# Altium schematic sheet foxbms2-interface-mc33664.SchDoc
size A3; DocumentNumber: 1; SheetNumber: 1; SheetTotal: 5; SheetDescription: TPL Communication
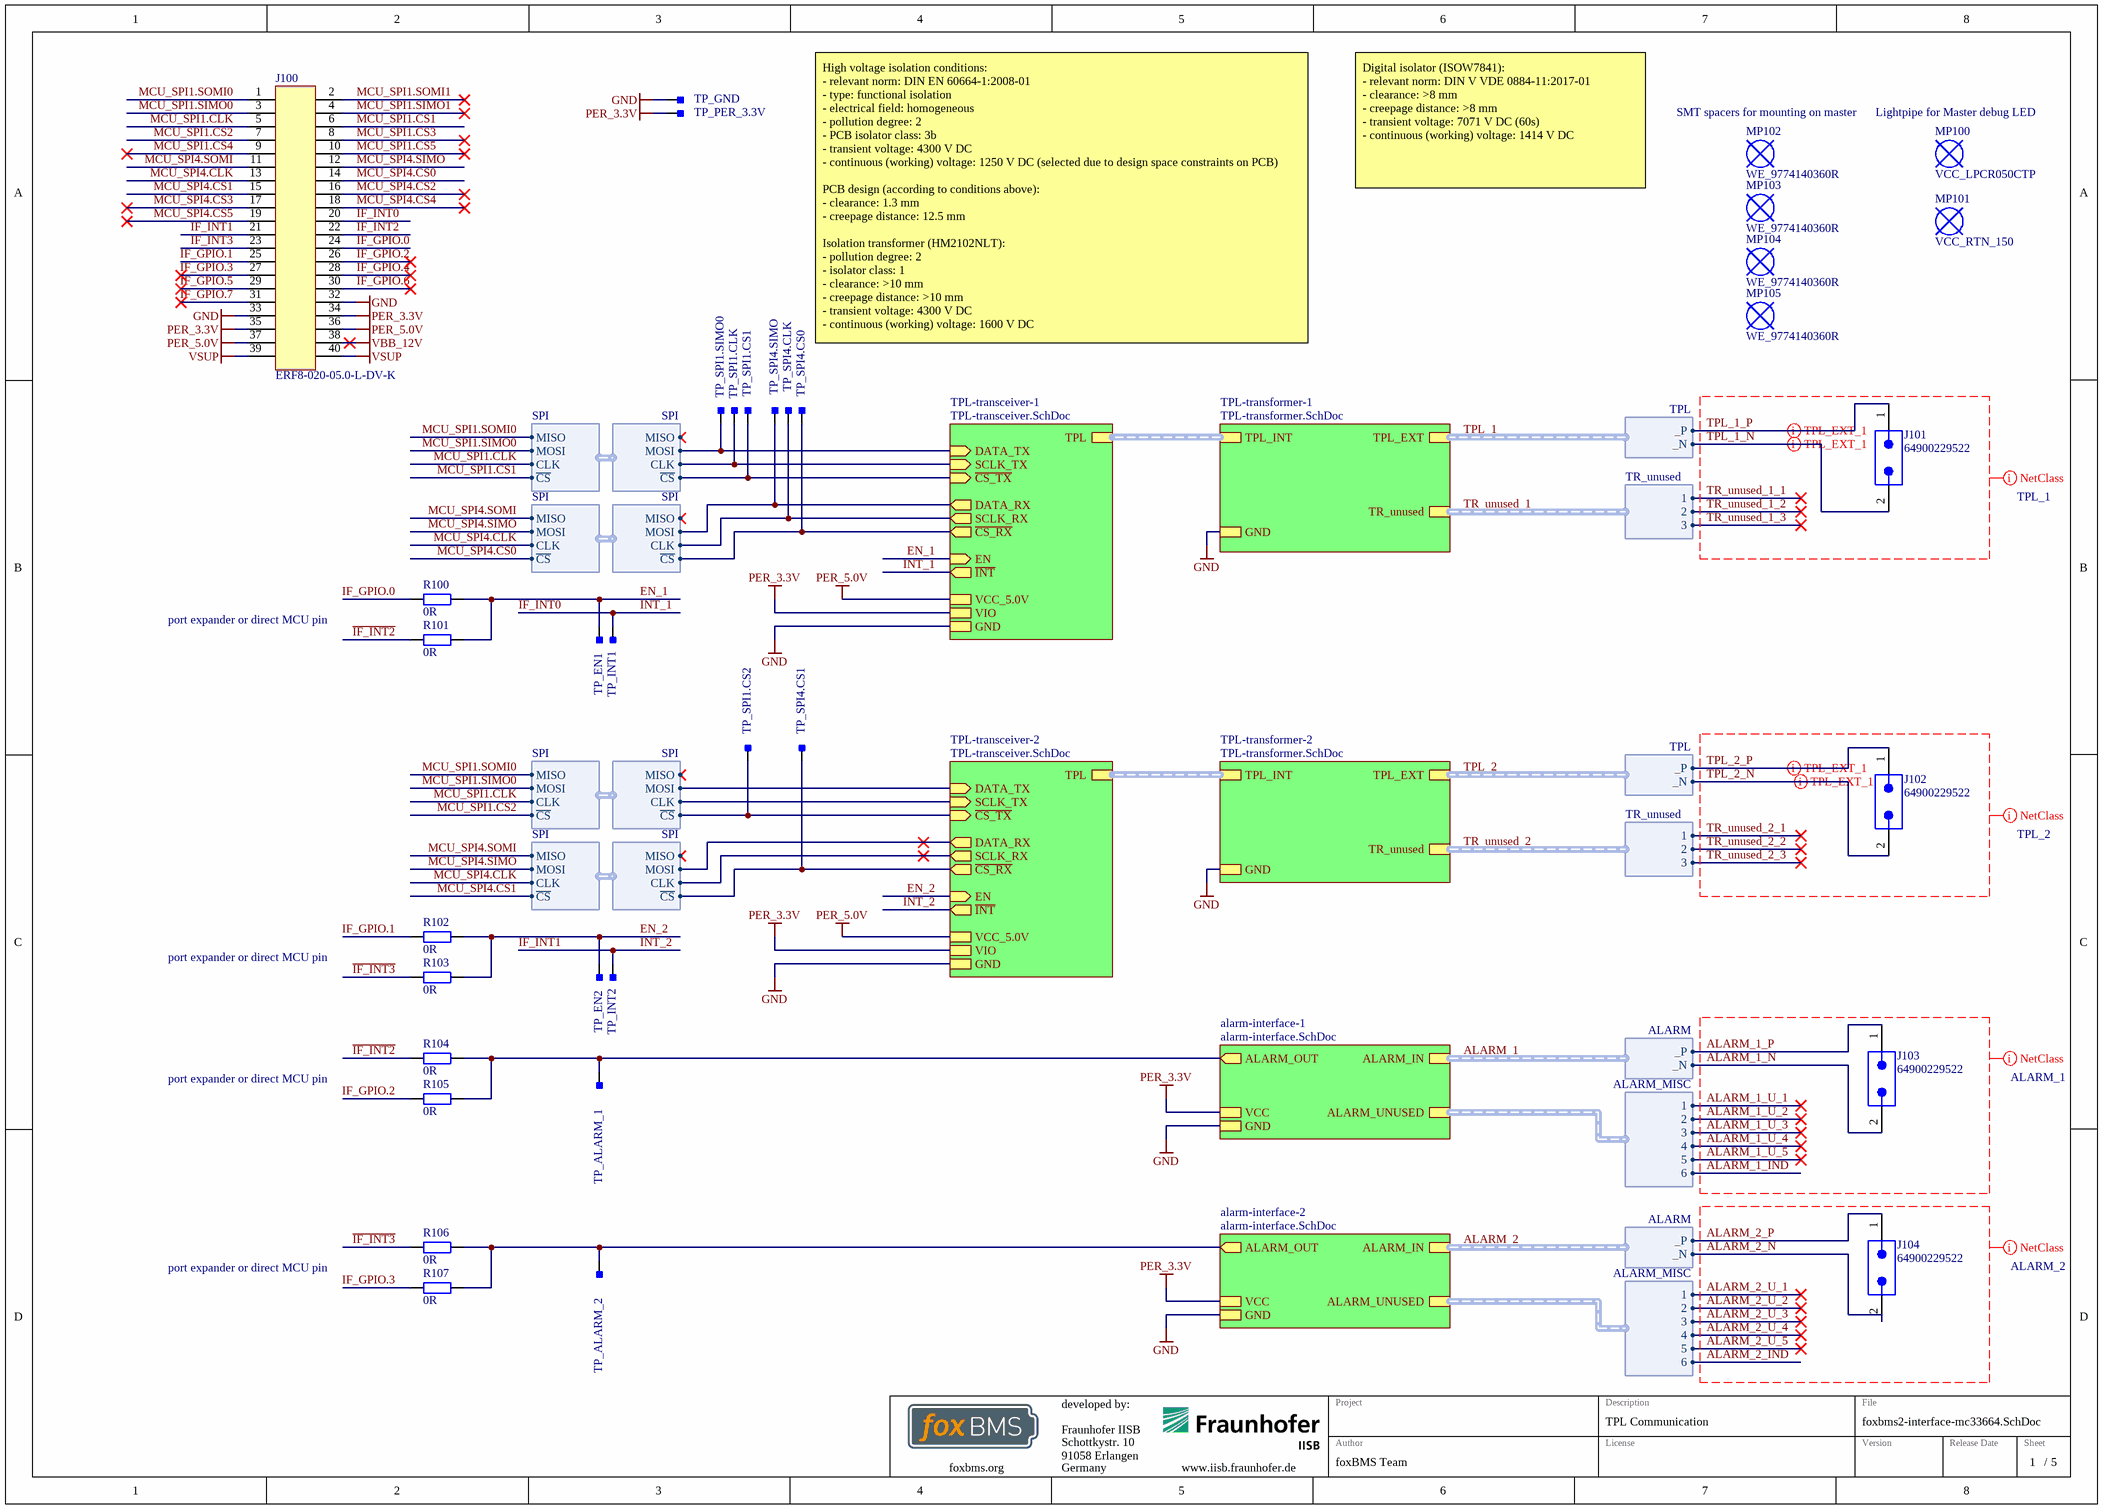
[diagram p0: foxbms2-interface-mc33664.SchDoc]

## Parts
J100  ERF8-020-05.0-L-DV-K  [SAMTEC_ERF8-020-05.0-L-DV-K]
J101  64900229522  [64900229522]
J102  64900229522  [64900229522]
J103  64900229522  [64900229522]
J104  64900229522  [64900229522]
MP100  VCC_LPCR050CTP  [VCC_LPCR050TP]  (mechanical)
MP101  VCC_RTN_150  [VCC_RTN_150]  (mechanical)
MP102  WE_9774140360R  [WE_9774140360]
MP103  WE_9774140360R  [WE_9774140360]
MP104  WE_9774140360R  [WE_9774140360]
MP105  WE_9774140360R  [WE_9774140360]
R100  0R  [RESC1608X05N]
R101  0R  [RESC1608X05N]
R102  0R  [RESC1608X05N]
R103  0R  [RESC1608X05N]
R104  0R  [RESC1608X05N]
R105  0R  [RESC1608X05N]
R106  0R  [RESC1608X05N]
R107  0R  [RESC1608X05N]
TP_ALARM_1  Testpoint_Square  [Testpoint_S1]  (value not drawn)  (no BOM)
TP_ALARM_2  Testpoint_Square  [Testpoint_S1]  (value not drawn)  (no BOM)
TP_EN1  Testpoint_Square  [Testpoint_S1]  (value not drawn)  (no BOM)
TP_EN2  Testpoint_Square  [Testpoint_S1]  (value not drawn)  (no BOM)
TP_GND  Testpoint_Square  [Testpoint_S1]  (value not drawn)  (no BOM)
TP_INT1  Testpoint_Square  [Testpoint_S1]  (value not drawn)  (no BOM)
TP_INT2  Testpoint_Square  [Testpoint_S1]  (value not drawn)  (no BOM)
TP_PER_3.3V  Testpoint_Square  [Testpoint_S1]  (value not drawn)  (no BOM)
TP_SPI1.CLK  Testpoint_Square  [Testpoint_S1]  (value not drawn)  (no BOM)
TP_SPI1.CS1  Testpoint_Square  [Testpoint_S1]  (value not drawn)  (no BOM)
TP_SPI1.CS2  Testpoint_Square  [Testpoint_S1]  (value not drawn)  (no BOM)
TP_SPI1.SIMO0  Testpoint_Square  [Testpoint_S1]  (value not drawn)  (no BOM)
TP_SPI4.CLK  Testpoint_Square  [Testpoint_S1]  (value not drawn)  (no BOM)
TP_SPI4.CS0  Testpoint_Square  [Testpoint_S1]  (value not drawn)  (no BOM)
TP_SPI4.CS1  Testpoint_Square  [Testpoint_S1]  (value not drawn)  (no BOM)
TP_SPI4.SIMO  Testpoint_Square  [Testpoint_S1]  (value not drawn)  (no BOM)

## Sub-sheets
alarm-interface-1 = alarm-interface.SchDoc: GND, VCC, ALARM_IN (harness ALARM), ALARM_OUT (out), ALARM_UNUSED (harness ALARM_MISC)
alarm-interface-2 = alarm-interface.SchDoc: GND, VCC, ALARM_IN (harness ALARM), ALARM_OUT (out), ALARM_UNUSED (harness ALARM_MISC)
TPL-transceiver-1 = TPL-transceiver.SchDoc: GND, EN (in), TPL (harness TPL), VIO, SCLK_TX (in), ~{CS_RX} (out), ~{INT} (out), DATA_RX (out), ~{CS_TX} (in), VCC_5.0V, DATA_TX (in), SCLK_RX (out)
TPL-transceiver-2 = TPL-transceiver.SchDoc: GND, EN (in), TPL (harness TPL), VIO, SCLK_TX (in), ~{CS_RX} (out), ~{INT} (out), DATA_RX (out), ~{CS_TX} (in), VCC_5.0V, DATA_TX (in), SCLK_RX (out)
TPL-transformer-1 = TPL-transformer.SchDoc: GND, TPL_INT (harness TPL), TPL_EXT (harness TPL), TR_unused (harness TR_unused)
TPL-transformer-2 = TPL-transformer.SchDoc: GND, TPL_INT (harness TPL), TPL_EXT (harness TPL), TR_unused (harness TR_unused)

## Harnesses
SPI: CLK, MOSI, MISO, ~{CS}
TPL: _P, _N
TR_unused: 1, 2, 3
ALARM: _P, _N
ALARM_MISC: 1, 2, 3, 4, 5, 6

## Nets
GND: J100.32 J100.33 TP_GND.1 ; sheet TPL-transceiver-1/GND, sheet TPL-transformer-1/GND, sheet TPL-transformer-2/GND, sheet TPL-transceiver-2/GND, sheet alarm-interface-1/GND, sheet alarm-interface-2/GND
PER_3.3V: J100.34 J100.35 TP_PER_3.3V.1 ; sheet TPL-transceiver-1/VIO, sheet TPL-transceiver-2/VIO, sheet alarm-interface-1/VCC, sheet alarm-interface-2/VCC
PER_5.0V: J100.36 J100.37 ; sheet TPL-transceiver-1/VCC_5.0V, sheet TPL-transceiver-2/VCC_5.0V
VBB_12V: J100.38
VSUP: J100.39 J100.40
~{IF_INT0}: J100.20 TP_INT1.1 ; sheet TPL-transceiver-1/~{INT}  [also labelled ~{INT_1}]
~{IF_INT1}: J100.21 TP_INT2.1 ; sheet TPL-transceiver-2/~{INT}  [also labelled ~{INT_2}]
~{IF_INT2}: J100.22 R101.1 R104.1
~{IF_INT3}: J100.23 R103.1 R106.1
~{MCU_SPI1.CS1}: J100.6 TP_SPI1.CS1.1 ; sheet TPL-transceiver-1/~{CS_TX}, harness SPI.~{CS}
~{MCU_SPI1.CS2}: J100.7 TP_SPI1.CS2.1 ; sheet TPL-transceiver-2/~{CS_TX}, harness SPI.~{CS}
~{MCU_SPI1.CS3}: J100.8
~{MCU_SPI1.CS4}: J100.9
~{MCU_SPI1.CS5}: J100.10
~{MCU_SPI4.CS0}: J100.14 TP_SPI4.CS0.1 ; sheet TPL-transceiver-1/~{CS_RX}, harness SPI.~{CS}
~{MCU_SPI4.CS1}: J100.15 TP_SPI4.CS1.1 ; sheet TPL-transceiver-2/~{CS_RX}, harness SPI.~{CS}
~{MCU_SPI4.CS2}: J100.16
~{MCU_SPI4.CS3}: J100.17
~{MCU_SPI4.CS4}: J100.18
~{MCU_SPI4.CS5}: J100.19
ALARM_1_IND: sheet alarm-interface-1/ALARM_UNUSED.6
ALARM_1_N: J103.2 ; sheet alarm-interface-1/ALARM_IN._N  [project net ALARM_1._N]
ALARM_1_P: J103.1 ; sheet alarm-interface-1/ALARM_IN._P  [project net ALARM_1._P]
ALARM_1_U_1: sheet alarm-interface-1/ALARM_UNUSED.1
ALARM_1_U_2: sheet alarm-interface-1/ALARM_UNUSED.2
ALARM_1_U_3: sheet alarm-interface-1/ALARM_UNUSED.3
ALARM_1_U_4: sheet alarm-interface-1/ALARM_UNUSED.4
ALARM_1_U_5: sheet alarm-interface-1/ALARM_UNUSED.5
ALARM_2_IND: sheet alarm-interface-2/ALARM_UNUSED.6
ALARM_2_N: J104.2 ; sheet alarm-interface-2/ALARM_IN._N  [project net ALARM_2._N]
ALARM_2_P: J104.1 ; sheet alarm-interface-2/ALARM_IN._P  [project net ALARM_2._P]
ALARM_2_U_1: sheet alarm-interface-2/ALARM_UNUSED.1
ALARM_2_U_2: sheet alarm-interface-2/ALARM_UNUSED.2
ALARM_2_U_3: sheet alarm-interface-2/ALARM_UNUSED.3
ALARM_2_U_4: sheet alarm-interface-2/ALARM_UNUSED.4
ALARM_2_U_5: sheet alarm-interface-2/ALARM_UNUSED.5
EN_1: R100.2 R101.2 TP_EN1.1 ; sheet TPL-transceiver-1/EN
EN_2: R102.2 R103.2 TP_EN2.1 ; sheet TPL-transceiver-2/EN
IF_GPIO.0: J100.24 R100.1
IF_GPIO.1: J100.25 R102.1
IF_GPIO.2: J100.26 R105.1
IF_GPIO.3: J100.27 R107.1
IF_GPIO.4: J100.28
IF_GPIO.5: J100.29
IF_GPIO.6: J100.30
IF_GPIO.7: J100.31
MCU_SPI1.CLK: J100.5 TP_SPI1.CLK.1 ; sheet TPL-transceiver-1/SCLK_TX, sheet TPL-transceiver-2/SCLK_TX, harness SPI.CLK
MCU_SPI1.SIMO0: J100.3 TP_SPI1.SIMO0.1 ; sheet TPL-transceiver-1/DATA_TX, sheet TPL-transceiver-2/DATA_TX, harness SPI.MOSI
MCU_SPI1.SIMO1: J100.4
MCU_SPI1.SOMI0: J100.1 ; harness SPI.MISO
MCU_SPI1.SOMI1: J100.2
MCU_SPI4.CLK: J100.13 TP_SPI4.CLK.1 ; sheet TPL-transceiver-1/SCLK_RX, sheet TPL-transceiver-2/SCLK_RX, harness SPI.CLK
MCU_SPI4.SIMO: J100.12 TP_SPI4.SIMO.1 ; sheet TPL-transceiver-1/DATA_RX, sheet TPL-transceiver-2/DATA_RX, harness SPI.MOSI
MCU_SPI4.SOMI: J100.11 ; harness SPI.MISO
TPL_1_N: J101.2 ; sheet TPL-transformer-1/TPL_EXT._N  [project net TPL_1._N]
TPL_1_P: J101.1 ; sheet TPL-transformer-1/TPL_EXT._P  [project net TPL_1._P]
TPL_2_N: J102.2 ; sheet TPL-transformer-2/TPL_EXT._N  [project net TPL_2._N]
TPL_2_P: J102.1 ; sheet TPL-transformer-2/TPL_EXT._P  [project net TPL_2._P]
TR_unused_1_1: sheet TPL-transformer-1/TR_unused.1  [project net TR_unused_1.1]
TR_unused_1_2: sheet TPL-transformer-1/TR_unused.2  [project net TR_unused_1.2]
TR_unused_1_3: sheet TPL-transformer-1/TR_unused.3  [project net TR_unused_1.3]
TR_unused_2_1: sheet TPL-transformer-2/TR_unused.1  [project net TR_unused_2.1]
TR_unused_2_2: sheet TPL-transformer-2/TR_unused.2  [project net TR_unused_2.2]
TR_unused_2_3: sheet TPL-transformer-2/TR_unused.3  [project net TR_unused_2.3]
NetR104_2: R104.2 R105.2 TP_ALARM_1.1 ; sheet alarm-interface-1/ALARM_OUT
NetR106_2: R106.2 R107.2 TP_ALARM_2.1 ; sheet alarm-interface-2/ALARM_OUT

## Buses and harness runs
harness ALARM_1 = sheet alarm-interface-1/ALARM_IN
harness ALARM_2 = sheet alarm-interface-2/ALARM_IN
harness sheet TPL-transceiver-1/TPL = sheet TPL-transformer-1/TPL_INT
harness sheet TPL-transceiver-2/TPL = sheet TPL-transformer-2/TPL_INT
harness TPL_1 = sheet TPL-transformer-1/TPL_EXT
harness TPL_2 = sheet TPL-transformer-2/TPL_EXT
harness TR_unused_1 = sheet TPL-transformer-1/TR_unused
harness TR_unused_2 = sheet TPL-transformer-2/TR_unused

## Layout directives
net class TPL_1: TPL_1_N, TPL_1_P, TR_unused_1_1, TR_unused_1_2, TR_unused_1_3
net class TPL_2: TPL_2_N, TPL_2_P, TR_unused_2_1, TR_unused_2_2, TR_unused_2_3
differential pair: TPL_1._N, TPL_1._P, TPL_2._N, TPL_2._P
net class ALARM_1: ALARM_1_IND, ALARM_1_N, ALARM_1_P, ALARM_1_U_1, ALARM_1_U_2, ALARM_1_U_3, ALARM_1_U_4, ALARM_1_U_5
net class ALARM_2: ALARM_2_IND, ALARM_2_N, ALARM_2_P, ALARM_2_U_1, ALARM_2_U_2, ALARM_2_U_3, ALARM_2_U_4, ALARM_2_U_5

## Notes on the sheet
- Digital isolator (ISOW7841):
  - relevant norm: DIN V VDE 0884-11:2017-01
  - clearance: >8 mm
  - creepage distance: >8 mm
  - transient voltage: 7071 V DC (60s)
  - continuous (working) voltage: 1414 V DC
- (near MP102) SMT spacers for mounting on master
- (near MP100) Lightpipe for Master debug LED
- High voltage isolation conditions:
  - relevant norm: DIN EN 60664-1:2008-01
  - type: functional isolation
  - electrical field: homogeneous
  - pollution degree: 2
  - PCB isolator class: 3b
  - transient voltage: 4300 V DC
  - continuous (working) voltage: 1250 V DC (selected due to design space constraints on PCB)
  PCB design (according to conditions above):
  - clearance: 1.3 mm
  - creepage distance: 12.5 mm
  Isolation transformer (HM2102NLT):
  - pollution degree: 2
  - isolator class: 1
  - clearance: >10 mm
  - creepage distance: >10 mm
  - transient voltage: 4300 V DC
  - continuous (working) voltage: 1600 V DC
- port expander or direct MCU pin
- Fraunhofer IISB
- Schottkystr. 10
- developed by:
- 91058 Erlangen
- Germany
- Author
- Project
- License
- Description
- File
- Version
- Release Date
- Sheet
- foxbms.org <https://foxbms.org>
- www.iisb.fraunhofer.de <https://www.iisb.fraunhofer.de/>
- foxBMS Team
- /

## Library data of the parts
J100 = SAMTEC_ERF8-020-05.0-L-DV-K: Edge Rate rugged high-speed connector strips; Manufacturer: Samtec; Circuits: 40; Automotive Qualified: False; Part Number: SAMTEC_ERF8-020-05.0-L-DV-K; Part Name: ERF8-020-05.0-L-DV-K; Operating Temperature: -55°C - +125°C; ComponentLink1Description: Datasheet; ComponentLink1URL: https://suddendocs.samtec.com/catalog_english/erf8-s.pdf; Supplier 1: Farnell; Supplier Part Number 1: 3771957; Supplier 2: Digikey; Supplier Part Number 2: SAM13550CT-ND; Supplier 3: Mouser; Supplier Part Number 3: 200-ERF8020050LDVKTR; ECCN: EAR99; System: Connector
J101-J104 = CMP-1502-00517-2: NexarPartId: 8917583; Operating Supply Voltage: 600V; Connector Type: Male Pin, Socket; Gender: Male; Current Rating: 9A; Insulation: Insulated; Insulation Resistance: 1GΩ; Number of Positions: 2; Contact Resistance: 10mΩ; Row Spacing: 5.5118mm; Pitch: 4.2mm; Contact Material: Copper; RoHS: Compliant; Lead Pitch: 4.2mm; Min Operating Temperature: -40°C; Housing Material: Nylon; Width: 5.4mm; Color: White; Number of Pins: 2; Mount: Through Hole; Number of Rows: 2; Fastening Type: Ramp; Flammability Rating: UL94 V-0; Termination: Through Hole; Height: 12.8mm; Length: 5.4mm; Contact Plating: Tin; Contact Gender: Male; Number of Contacts: 2; Max Operating Temperature: 105°C; REACH SVHC: Unknown; Voltage Rating: 600V
MP100 = VCC_LPCR050CTP: Lightpipe Clear LPCR Series; Manufacturer: VCC; Automotive Qualified: False; Part Number: VCC_LPCR050CTP; Part Name: VCC_LPCR050CTP; ComponentLink1Description: Datasheet; ComponentLink1URL: https://vcclite.com/wp-content/uploads/wpallimport/files/files/LPCR.pdf; Supplier 1: Digikey; Supplier Part Number 1: LPCR050CTP-ND; Supplier 2: Mouser; Supplier Part Number 2: 593-LPCR050CTP; ECCN: EAR99
MP101 = VCC_RTN_150: Grommet Retainer for LPC and LPCR Series Light Pipe; Manufacturer: VCC; Automotive Qualified: False; Part Number: VCC_RTN_150; Part Name: VCC_RTN_150; ComponentLink1Description: Datasheet; ComponentLink1URL: https://vcclite.com/?file=files/RTN_150.pdf&file_name=RTN_150.pdf; Supplier 1: Digikey; Supplier Part Number 1: RTN_150-ND; Supplier 2: Mouser; Supplier Part Number 2: 593-RTN150; ECCN: EAR99
MP102-MP105 = WE_9774140360R: WA-SMSI SMT Steel Spacer with internal thread M 3; Manufacturer: Würth Elektronik; Automotive Qualified: False; Part Number: WE_9774140360R; Part Name: WE_9774140360R; Operating Temperature: -55°C - +150°C; ComponentLink1Description: Datasheet; ComponentLink1URL: https://www.we-online.com/catalog/datasheet/9774140360R.pdf; Supplier 1: Digikey; Supplier Part Number 1: 732-5281-1-ND; Supplier 2: Mouser; Supplier Part Number 2: 710-9774140360R; ECCN: EAR99
R100-R107 = gen_R_0R_0603: SMD Resistor 0R 0603; Power: 0.1W; Case EIA: 0603; Case Metric: 1608; Maximum Working Voltage: 75V; PnP Package: 0603R; PnP equipped: x; Automotive Qualified: True; Part Number: gen_R_0R_0603; Operating Temperature: -55°C - +155°C; Resistance: 0R; Series: Jumper; PnP Value: 0R; Supplier 1: Farnell; Supplier Part Number 1: 2616580
TP_ALARM_1 TP_ALARM_2 TP_EN1 TP_EN2 TP_GND TP_INT1 TP_INT2 TP_PER_3.3V TP_SPI1.CLK TP_SPI1.CS1 TP_SPI1.CS2 TP_SPI1.SIMO0 TP_SPI4.CLK TP_SPI4.CS0 TP_SPI4.CS1 TP_SPI4.SIMO = Testpoint_Square: Testpoint, square; Automotive Qualified: False; Part Number: Testpoint_Square